# EAGLE schematic UDAWA-Aktuator4CH (EAGLE 9.6.2)
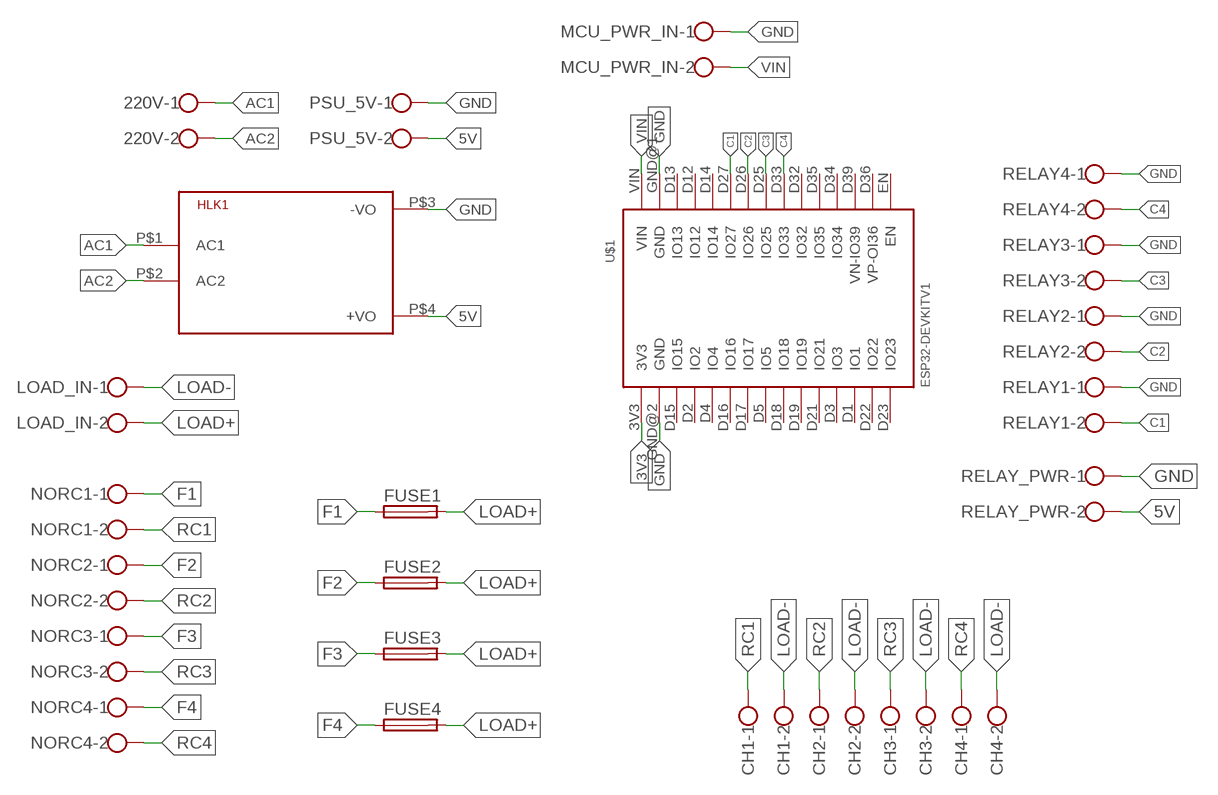
[diagram p0: schematic, sheet 1]

## Parts
220V  W237-102  [W237-102]
CH1  W237-102  [W237-102]
CH2  W237-102  [W237-102]
CH3  W237-102  [W237-102]
CH4  W237-102  [W237-102]
FUSE1  SH22,5A  [SH22,5A]
FUSE2  SH22,5A  [SH22,5A]
FUSE3  SH22,5A  [SH22,5A]
FUSE4  SH22,5A  [SH22,5A]
HLK1  HLK-PM013W  [HLK-PM01]
LOAD_IN  W237-102  [W237-102]
MCU_PWR_IN  W237-102  [W237-102]
NORC1  W237-102  [W237-102]
NORC2  W237-102  [W237-102]
NORC3  W237-102  [W237-102]
NORC4  W237-102  [W237-102]
PSU_5V  W237-102  [W237-102]
RELAY1  W237-102  [W237-102]
RELAY2  W237-102  [W237-102]
RELAY3  W237-102  [W237-102]
RELAY4  W237-102  [W237-102]
RELAY_PWR  W237-102  [W237-102]
U$1  ESP32DEVKITV1  [ESP32-DEVKITV1]

## Nets
3V3: U$1.3V3
5V: HLK1.P$4(+VO) PSU_5V.2 RELAY_PWR.2
AC1: 220V.1 HLK1.P$1(AC1)
AC2: 220V.2 HLK1.P$2(AC2)
C1: RELAY1.2 U$1.D27(IO27)
C2: RELAY2.2 U$1.D26(IO26)
C3: RELAY3.2 U$1.D25(IO25)
C4: RELAY4.2 U$1.D33(IO33)
F1: FUSE1.1 NORC1.1
F2: FUSE2.1 NORC2.1
F3: FUSE3.1 NORC3.1
F4: FUSE4.1 NORC4.1
GND: HLK1.P$3(-VO) MCU_PWR_IN.1 PSU_5V.1 RELAY1.1 RELAY2.1 RELAY3.1 RELAY4.1 RELAY_PWR.1 U$1.GND@1(GND) U$1.GND@2(GND)
LOAD+: FUSE1.2 FUSE2.2 FUSE3.2 FUSE4.2 LOAD_IN.2
LOAD-: CH1.2 CH2.2 CH3.2 CH4.2 LOAD_IN.1
RC1: CH1.1 NORC1.2
RC2: CH2.1 NORC2.2
RC3: CH3.1 NORC3.2
RC4: CH4.1 NORC4.2
VIN: MCU_PWR_IN.2 U$1.VIN
Unconnected: U$1.D1(IO1) U$1.D2(IO2) U$1.D3(IO3) U$1.D4(IO4) U$1.D5(IO5) U$1.D12(IO12) U$1.D13(IO13) U$1.D14(IO14) U$1.D15(IO15) U$1.D16(IO16) U$1.D17(IO17) U$1.D18(IO18) U$1.D19(IO19) U$1.D21(IO21) U$1.D22(IO22) U$1.D23(IO23) U$1.D32(IO32) U$1.D34(IO34) U$1.D35(IO35) U$1.D36(VP-OI36) U$1.D39(VN-IO39) U$1.EN

## Library data of the parts
220V CH1-CH4 LOAD_IN MCU_PWR_IN NORC1-NORC4 PSU_5V RELAY1-RELAY4 RELAY_PWR = con-wago-500:W237-102: WAGO SCREW CLAMP; MPN: 237-102; OC_FARNELL: unknown; OC_NEWARK: 70K9898
FUSE1-FUSE4 = fuse:SH22,5A: FUSE HOLDER grid 22,5mm, isolated cap OGN0031 8201, Schurter (Buerklin); MPN: 0031.7701.11; OC_FARNELL: unknown; OC_NEWARK: 04F1224
HLK1 = HLK-PM01:HLK-PM01: Hi-Link Power Supply HLK-PM01 3W Author: Ahmed Said <https://github.com/AhmedSaid/EAGLELibraries>
U$1 = ESP32-DEVKITV1:ESP32DEVKITV1